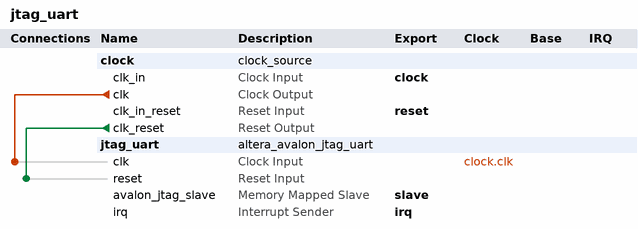
[diagram p0: system contents]
# Platform Designer (Qsys) system jtag_uart, Cyclone IV E EP4CE22F17C6
# Parameters at their usual value, and those the tool derives, are not listed.
package require -exact qsys 20.1
create_system jtag_uart
set_project_property DEVICE_FAMILY {Cyclone IV E}
set_project_property DEVICE EP4CE22F17C6

add_instance clock clock_source 20.1
set_instance_parameter_value clock clockFrequency 50000000
set_instance_parameter_value clock resetSynchronousEdges BOTH

add_instance jtag_uart altera_avalon_jtag_uart 20.1
set_instance_parameter_value jtag_uart readBufferDepth 8
set_instance_parameter_value jtag_uart readIRQThreshold 4
set_instance_parameter_value jtag_uart simInteractiveOptions NO_INTERACTIVE_WINDOWS
set_instance_parameter_value jtag_uart useRegistersForReadBuffer true
set_instance_parameter_value jtag_uart useRegistersForWriteBuffer true
set_instance_parameter_value jtag_uart writeBufferDepth 8
set_instance_parameter_value jtag_uart writeIRQThreshold 4

# connections
add_connection clock.clk jtag_uart.clk clock
add_connection clock.clk_reset jtag_uart.reset reset

# exported interfaces
add_interface clock clock sink
set_interface_property clock EXPORT_OF clock.clk_in
add_interface irq interrupt sender
set_interface_property irq EXPORT_OF jtag_uart.irq
add_interface reset reset sink
set_interface_property reset EXPORT_OF clock.clk_in_reset
add_interface slave avalon slave
set_interface_property slave EXPORT_OF jtag_uart.avalon_jtag_slave

set_interconnect_requirement {$system} qsys_mm.clockCrossingAdapter HANDSHAKE
set_interconnect_requirement {$system} qsys_mm.insertDefaultSlave false
set_interconnect_requirement {$system} qsys_mm.maxAdditionalLatency 1

save_system jtag_uart.qsys
